# EAGLE design gc1 (EAGLE 6.4)
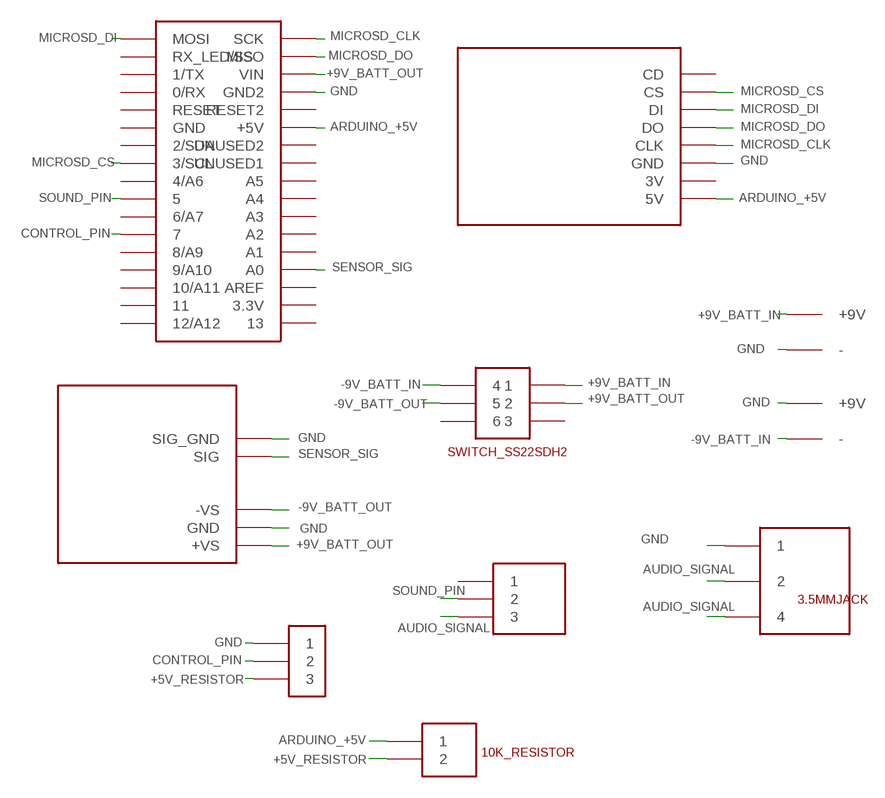
[diagram p0: schematic, sheet 1]

## Parts
3.5MMJACK  35RAPC2BVN4  [35RAPC4BVN4]
10K_RESISTOR  10K_RESISTOR  [10K_RESISTOR]
ARDUINOMICRO  ARDUINO_MICRO  [ARDUINO_MICRO]
TRIMMER  66WR1KLF  [66WR1KLF]
U$2  MICROSD  [MICROSD]
U$3  MUSCLE_SENSOR  [MUSCLE_SENSOR]
U$4  SWITCH_SS22SDH2  [SWITCH_SS22SDH2]
U$5  9V_CONNECTOR  [9V_CONNECTOR]
U$6  9V_CONNECTOR  [9V_CONNECTOR]
U$9  SWITCH_SS12SDH2  [SWITCH_SS12SDH2]

## Nets
+5V_RESISTOR: 10K_RESISTOR.2 U$9.3
+9V_BATT_IN: U$4.1 U$5.+9V
+9V_BATT_OUT: ARDUINOMICRO.VIN U$3.+VS U$4.2
-9V_BATT_IN: U$4.4 U$6.-
-9V_BATT_OUT: U$3.-VS U$4.5
ARDUINO_+5V: 10K_RESISTOR.1 ARDUINOMICRO.+5V U$2.5V
AUDIO_SIGNAL: 3.5MMJACK.2 3.5MMJACK.4 TRIMMER.3
CONTROL_PIN: ARDUINOMICRO.7 U$9.2
GND: 3.5MMJACK.1 ARDUINOMICRO.GND2 U$2.GND U$3.GND U$3.SIG_GND U$5.- U$6.+9V U$9.1
MICROSD_CLK: ARDUINOMICRO.SCK U$2.CLK
MICROSD_CS: ARDUINOMICRO.3/SCL U$2.CS
MICROSD_DI: ARDUINOMICRO.MOSI U$2.DI
MICROSD_DO: ARDUINOMICRO.MISO U$2.DO
SENSOR_SIG: ARDUINOMICRO.A0 U$3.SIG
SOUND_PIN: ARDUINOMICRO.5 TRIMMER.2
Unconnected: ARDUINOMICRO.0/RX ARDUINOMICRO.1/TX ARDUINOMICRO.2/SDA ARDUINOMICRO.3.3V ARDUINOMICRO.4/A6 ARDUINOMICRO.6/A7 ARDUINOMICRO.8/A9 ARDUINOMICRO.9/A10 ARDUINOMICRO.10/A11 ARDUINOMICRO.11 ARDUINOMICRO.12/A12 ARDUINOMICRO.13 ARDUINOMICRO.A1 ARDUINOMICRO.A2 ARDUINOMICRO.A3 ARDUINOMICRO.A4 ARDUINOMICRO.A5 ARDUINOMICRO.AREF ARDUINOMICRO.GND ARDUINOMICRO.RESET ARDUINOMICRO.RESET2 ARDUINOMICRO.RX_LED/SS ARDUINOMICRO.UNUSED1 ARDUINOMICRO.UNUSED2 TRIMMER.1 U$2.3V U$2.CD U$4.3 U$4.6

## Library data of the parts
3.5MMJACK = gc1_parts:35RAPC2BVN4
10K_RESISTOR = gc1_parts:10K_RESISTOR
ARDUINOMICRO = gc1_parts:ARDUINO_MICRO
TRIMMER = gc1_parts:66WR1KLF
U$2 = gc1_parts:MICROSD
U$3 = gc1_parts:MUSCLE_SENSOR
U$4 = gc1_parts:SWITCH_SS22SDH2
U$5 U$6 = gc1_parts:9V_CONNECTOR
U$9 = gc1_parts:SWITCH_SS12SDH2

## Net classes
0 default: width 0.61 mm

## Board
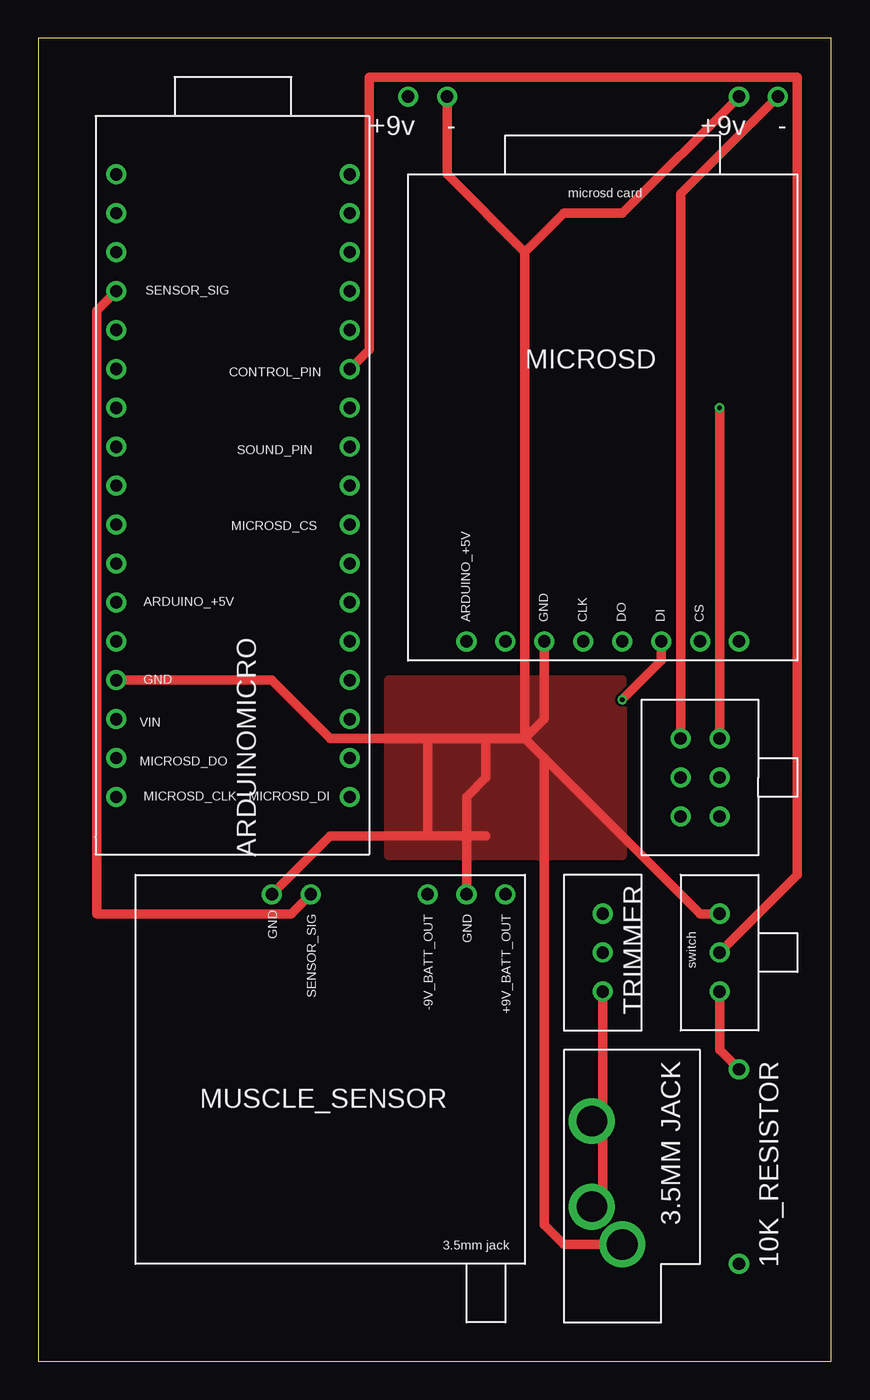
[diagram p1: board, top side]
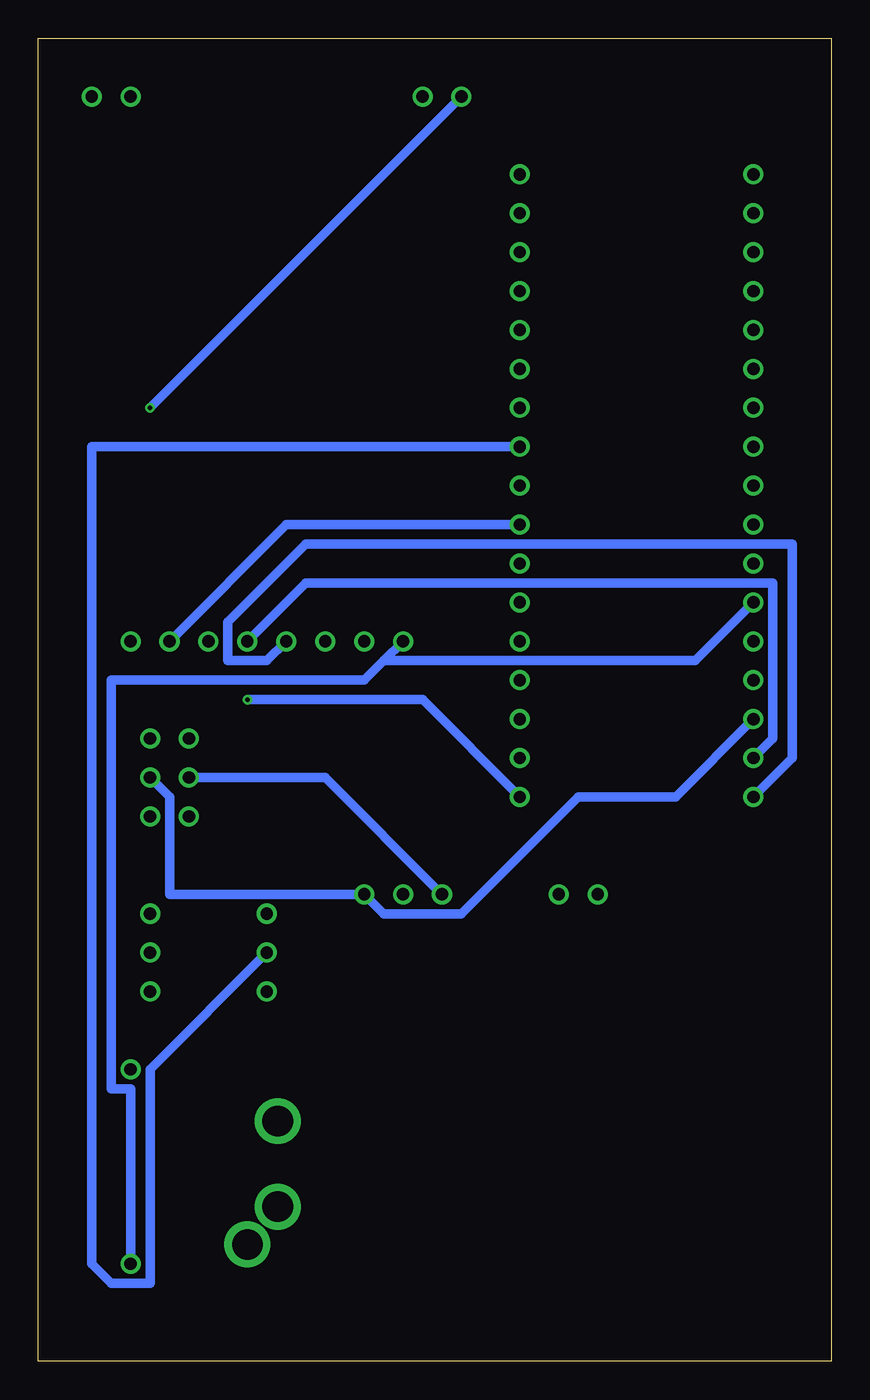
[diagram p2: board, bottom side, seen from below]

Size 51.74 x 86.35 mm. Coordinates in mm from the lower left corner, seen from the top.
Outline: 0,0 51.74,0 51.74,86.35 0,86.35 0,0
Copper layers (1*16): Top 0.035mm / dielectric 1.5mm / Bottom 0.035mm
Design rules "Fusion_eagle_rule_v1.1 *": minimum track width 12mil, minimum drill 12mil, track to track 6mil, track to pad 6mil, pad to pad 6mil, via to via 6mil, smd to smd 0mil, copper to edge 10mil, drill to drill 10mil, minimum pad ring 10mil, minimum via ring 6mil, stop-mask expansion 2mil, vias tented up to drill 100mil, thermal gap 10mil

### Footprints (pad centres in the part's own frame; a part is rotated, then mirrored left to right if it is on the bottom)
35RAPC4BVN4 = drill 2: 1 0,0; 2 2.464,1.981; 4 8.052,1.981
10K_RESISTOR = drill 0.8: 1 0,0; 2 12.7,0
ARDUINO_MICRO = drill 0.8: 0/RX 33.02,0; 1/TX 35.56,0; 2/SDA 25.4,0; 3.3V 2.54,-15.24; 3/SCL 22.86,0; 4/A6 20.32,0; 5 17.78,0; 6/A7 15.24,0; 7 12.7,0; 8/A9 10.16,0; 9/A10 7.62,0; 10/A11 5.08,0; 11 2.54,0; 12/A12 0,0; 13 0,-15.24; +5V 27.94,-15.24; A0 7.62,-15.24; A1 10.16,-15.24; A2 12.7,-15.24; A3 15.24,-15.24; A4 17.78,-15.24; A5 20.32,-15.24; AREF 5.08,-15.24; GND 27.94,0; GND2 33.02,-15.24; MISO 38.1,-15.24; MOSI 40.64,0; RESET 30.48,0; RESET2 30.48,-15.24; RX_LED/SS 38.1,0; SCK 40.64,-15.24; UNUSED1 22.86,-15.24; UNUSED2 25.4,-15.24; VIN 35.56,-15.24
66WR1KLF = drill 0.8: 1 2.54,0; 2 0,0; 3 -2.54,0
MICROSD = drill 0.8: 3V 6.35,-30.48; 5V 3.81,-30.48; CD 21.59,-30.48; CLK 11.43,-30.48; CS 19.05,-30.48; DI 16.51,-30.48; DO 13.97,-30.48; GND 8.89,-30.48
MUSCLE_SENSOR = drill 0.8: +VS 1.27,-24.13; -VS 6.35,-24.13; GND 3.81,-24.13; SIG 13.97,-24.13; SIG_GND 16.51,-24.13
SWITCH_SS22SDH2 = drill 0.8: 1 5.08,-2.54; 2 5.08,-5.08; 3 5.08,-7.62; 4 2.54,-2.54; 5 2.54,-5.08; 6 2.54,-7.62
9V_CONNECTOR = drill 0.8: +9V 0,0; - 2.54,0
SWITCH_SS12SDH2 = drill 0.8: 1 2.54,-2.54; 2 2.54,-5.08; 3 2.54,-7.62

### Placement (x,y rotation side)
3.5MMJACK  38.1,7.62 90 top
10K_RESISTOR  45.72,6.35 90 top
ARDUINOMICRO  20.32,77.47 270 top
TRIMMER  36.83,26.67 90 top
U$2  24.13,77.47 0 top
U$3  31.75,6.35 180 top
U$4  39.37,43.18 0 top
U$5  24.13,82.55 0 top
U$6  45.72,82.55 0 top
U$9  41.91,31.75 0 top

### Tracks (layer width: path | path; a pad name or v marks a point on that pad's centre or on a via)
+5V_RESISTOR
  Top 0.61: 10K_RESISTOR.2 44.45,20.32 U$9.3
+9V_BATT_IN  (via drill 0.3)
  Top 0.61: v44.45,62.23 U$4.1
  Bottom 0.61: U$5.+9V v44.45,62.23
+9V_BATT_OUT
  Bottom 0.61: ARDUINOMICRO.VIN 10.16,36.83 16.51,36.83 24.13,29.21 29.21,29.21 U$3.+VS 43.18,30.48 43.18,36.83 U$4.2
-9V_BATT_IN
  Top 0.61: U$4.4 41.91,76.2 U$6.-
-9V_BATT_OUT
  Bottom 0.61: U$3.-VS 33.02,38.1 U$4.5
ARDUINO_+5V
  Bottom 0.61: 10K_RESISTOR.1 45.72,17.78 46.99,17.78 46.99,44.45 30.48,44.45 29.21,45.72 | U$2.5V 29.21,45.72 | ARDUINOMICRO.+5V 8.89,45.72 29.21,45.72
AUDIO_SIGNAL
  Top 0.61: TRIMMER.3 36.83,16.51 3.5MMJACK.4 36.83,15.24 36.83,10.16 3.5MMJACK.2
CONTROL_PIN
  Top 0.61: U$9.2 49.53,31.75 49.53,83.82 21.59,83.82 21.59,66.04 ARDUINOMICRO.7
GND
  Top 0.61: ARDUINOMICRO.GND2 15.24,44.45 19.05,40.64 25.4,40.64 | 25.4,40.64 29.21,40.64 | 29.21,40.64 31.75,40.64 | 31.75,40.64 33.02,41.91 U$2.GND | U$5.- 26.67,77.47 31.75,72.39 | 31.75,40.64 31.75,72.39 | 31.75,72.39 34.29,74.93 38.1,74.93 U$6.+9V | U$3.GND 27.94,34.29 | 27.94,34.29 27.94,36.83 29.21,38.1 29.21,40.64 | U$9.1 43.18,29.21 33.02,39.37 | 3.5MMJACK.1 34.29,7.62 33.02,8.89 33.02,39.37 | 33.02,39.37 31.75,40.64 | U$3.SIG_GND 19.05,34.29 25.4,34.29 | 25.4,34.29 25.4,40.64 | 29.21,34.29 27.94,34.29 | 27.94,34.29 25.4,34.29
  pour Top: 22.86,44.45 38.1,44.45 38.1,33.02 22.86,33.02
MICROSD_CLK
  Bottom 0.61: ARDUINOMICRO.SCK 2.54,39.37 2.54,53.34 34.29,53.34 39.37,48.26 39.37,45.72 36.83,45.72 U$2.CLK
MICROSD_CS
  Bottom 0.61: ARDUINOMICRO.3/SCL 35.56,54.61 U$2.CS
MICROSD_DI  (via drill 0.3)
  Top 0.61: v38.1,43.18 40.64,45.72 U$2.DI
  Bottom 0.61: ARDUINOMICRO.MOSI 26.67,43.18 v38.1,43.18
MICROSD_DO
  Bottom 0.61: ARDUINOMICRO.MISO 3.81,40.64 3.81,50.8 34.29,50.8 U$2.DO
SENSOR_SIG
  Top 0.61: U$3.SIG 16.51,29.21 3.81,29.21 3.81,68.58 ARDUINOMICRO.A0
SOUND_PIN
  Bottom 0.61: TRIMMER.2 44.45,19.05 44.45,5.08 46.99,5.08 48.26,6.35 48.26,59.69 ARDUINOMICRO.5